# EAGLE design schematic (EAGLE 9.4.0)
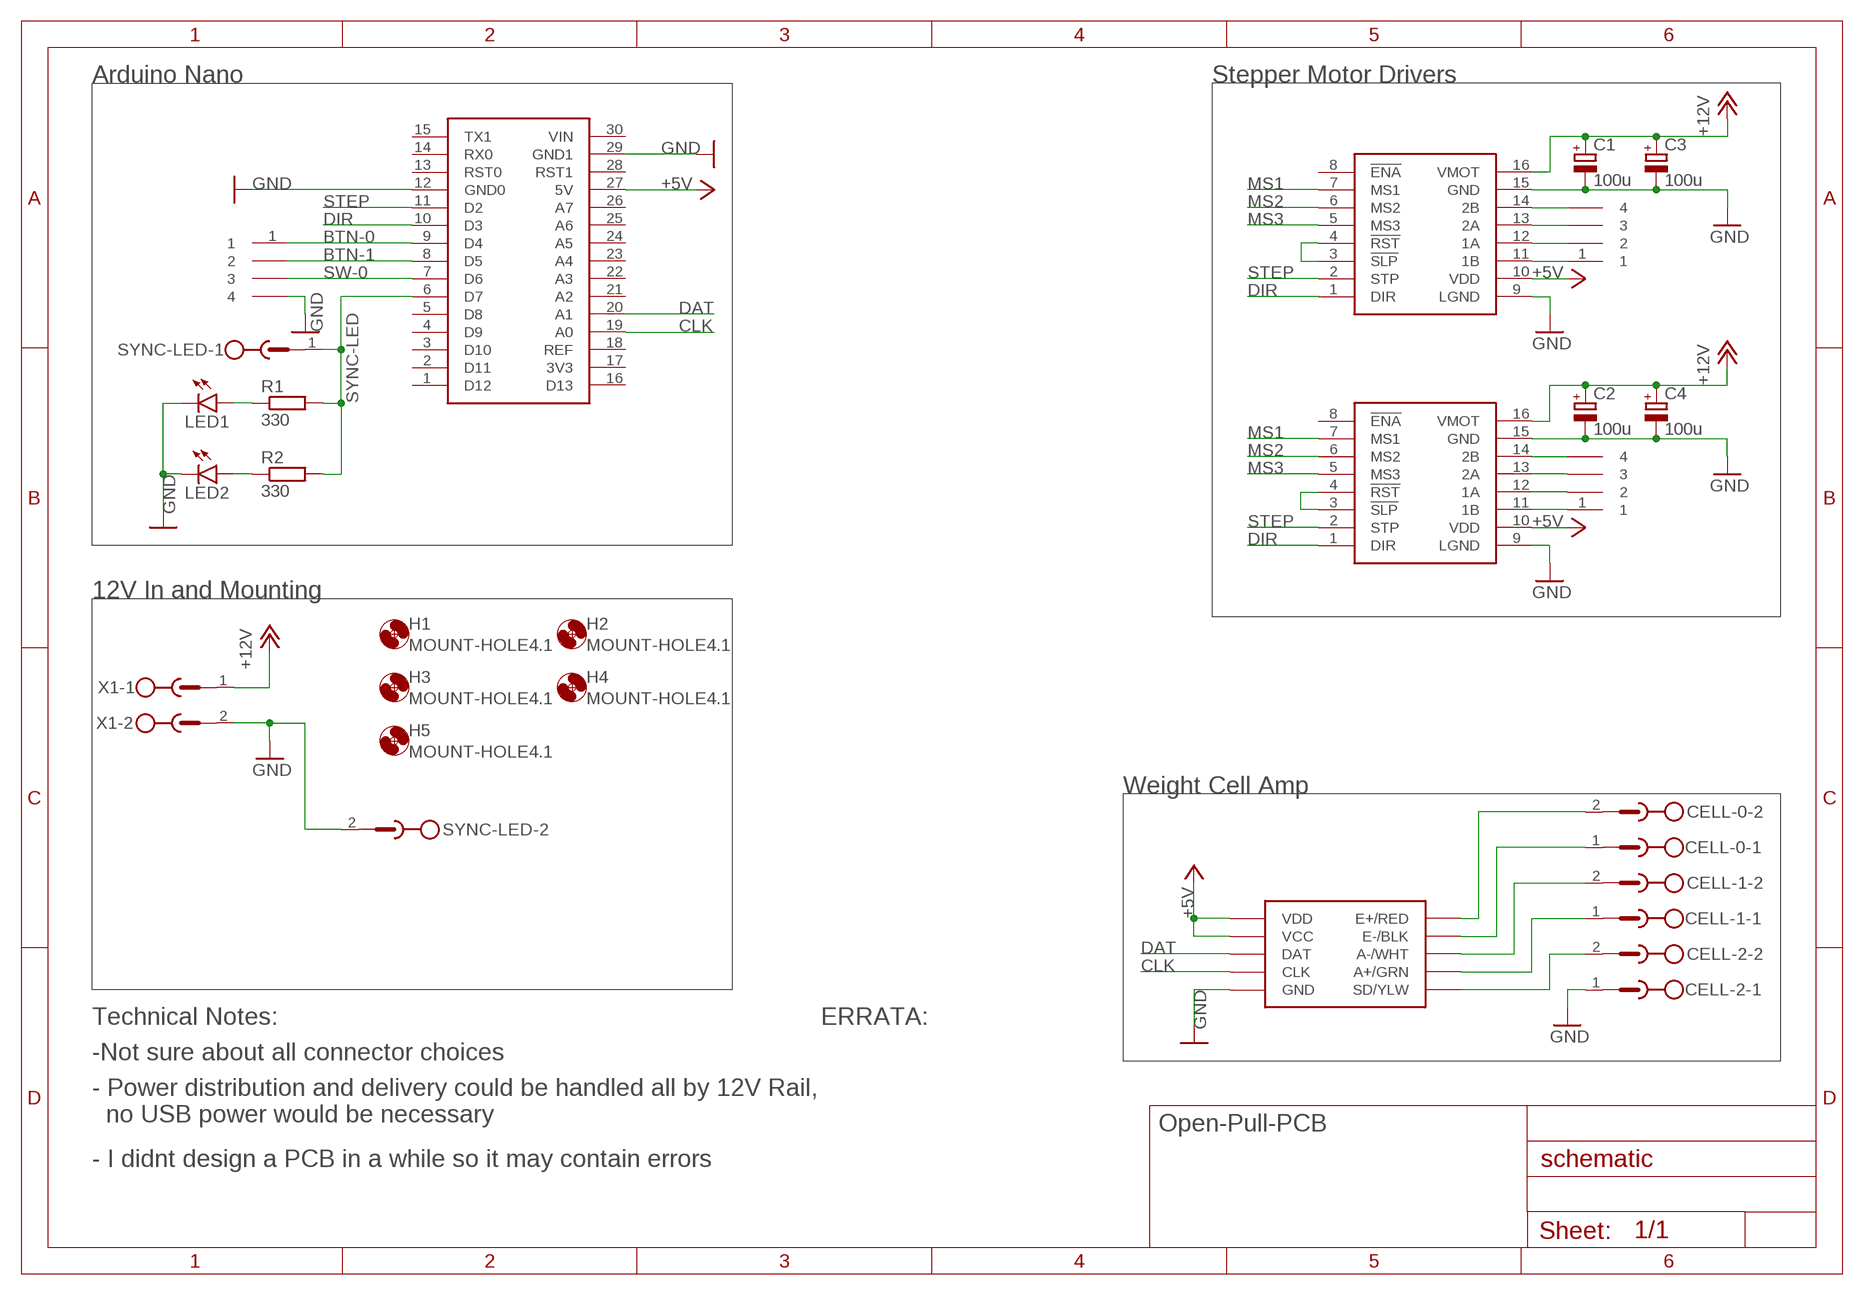
[diagram p0: schematic, sheet 1]

## Parts
C1  100u  CPOL  [3.5MM-CAP]
C2  100u  CPOL  [3.5MM-CAP]
C3  100u  CPOLSMD-CAP  [CAPAE830X1050]
C4  100u  CPOLSMD-CAP  [CAPAE830X1050]
CELL-0  MSTBV2  [MSTBV2]
CELL-1  MSTBV2  [MSTBV2]
CELL-2  MSTBV2  [MSTBV2]
CON1  CON-4GENERIC  [HDRV4W64P254_1X4_1016X508X838B]
CON2  CON-4GENERIC  [HDRV4W64P254_1X4_1016X508X838B]
CON3  CON-4GENERIC  [HDRV4W64P254_1X4_1016X508X838B]
DRIVER1  A4988-MODULE  [POLULU-A4988]
DRIVER2  A4988-MODULE  [POLULU-A4988]
H1  MOUNT-HOLE4.1  [4,1]
H2  MOUNT-HOLE4.1  [4,1]
H3  MOUNT-HOLE4.1  [4,1]
H4  MOUNT-HOLE4.1  [4,1]
H5  MOUNT-HOLE4.1  [4,1]
LED1  LEDCHIP-LED0805  [CHIP-LED0805]
LED2  LED3MM  [LED3MM]
MODULE1  HX711-MODULE  [SPARKFUN-HX711]
NANO1  ARDUINO-NANO  [ARDUINO-NANO]
R1  330  R-EU_R0805  [R0805]
R2  330  R-EU_0207/2V  [0207/2V]
SYNC-LED  MSTBV2  [MSTBV2]
X1  MSTBV2  [MSTBV2]

## Nets
+5V: DRIVER1.10(VDD) DRIVER2.10(VDD) MODULE1.VCC MODULE1.VDD NANO1.27(5V)
+12V: C1.+ C2.+ C3.1(+) C4.1(+) DRIVER1.16(VMOT) DRIVER2.16(VMOT) X1.1
BTN-0: CON3.1 NANO1.9(D4)
BTN-1: CON3.2 NANO1.8(D5)
CLK: MODULE1.CLK NANO1.19(A0)
DAT: MODULE1.DAT NANO1.20(A1)
DIR: DRIVER1.1(DIR) DRIVER2.1(DIR) NANO1.10(D3)
GND: C1.- C2.- C3.2(-) C4.2(-) CELL-2.1 CON3.4 DRIVER1.9(LGND) DRIVER1.15(GND) DRIVER2.9(LGND) DRIVER2.15(GND) LED1.C LED2.K(C) MODULE1.GND NANO1.12(GND0) NANO1.29(GND1) SYNC-LED.2 X1.2
MS1: DRIVER1.7(MS1) DRIVER2.7(MS1)
MS2: DRIVER1.6(MS2) DRIVER2.6(MS2)
MS3: DRIVER1.5(MS3) DRIVER2.5(MS3)
N$1: DRIVER2.3(!SLP) DRIVER2.4(!RST)
N$2: DRIVER1.3(!SLP) DRIVER1.4(!RST)
N$5: CON1.1 DRIVER1.11(1B)
N$6: CON1.2 DRIVER1.12(1A)
N$7: CON1.3 DRIVER1.13(2A)
N$8: CON1.4 DRIVER1.14(2B)
N$9: CON2.1 DRIVER2.11(1B)
N$10: CON2.2 DRIVER2.12(1A)
N$11: CON2.3 DRIVER2.13(2A)
N$12: CON2.4 DRIVER2.14(2B)
N$13: CELL-0.2 MODULE1.RED(E+/RED)
N$14: CELL-0.1 MODULE1.BLK(E-/BLK)
N$15: CELL-1.2 MODULE1.WHT(A-/WHT)
N$16: LED1.A R1.1
N$17: CELL-1.1 MODULE1.GRN(A+/GRN)
N$18: LED2.A R2.1
N$19: CELL-2.2 MODULE1.YEL(SD/YLW)
STEP: DRIVER1.2(STP) DRIVER2.2(STP) NANO1.11(D2)
SW-0: CON3.3 NANO1.7(D6)
SYNC-LED: NANO1.6(D7) R1.2 R2.2 SYNC-LED.1
Unconnected: DRIVER1.8(!ENA) DRIVER2.8(!ENA) NANO1.1(D12) NANO1.2(D11) NANO1.3(D10) NANO1.4(D9) NANO1.5(D8) NANO1.13(RST0) NANO1.14(RX0) NANO1.15(TX1) NANO1.16(D13) NANO1.18(REF) NANO1.21(A2) NANO1.22(A3) NANO1.23(A4) NANO1.24(A5) NANO1.25(A6) NANO1.26(A7) NANO1.28(RST1)

## Notes on the sheet
- Arduino Nano | Stepper Motor Drivers
- 12V In and Mounting
- Weight Cell Amp
- Technical Notes:
- ERRATA:
- -Not sure about all connector choices
- - Power distribution and delivery could be handled all by 12V Rail, 
    no USB power would be necessary
- Open-Pull-PCB
- - I didnt design a PCB in a while so it may contain errors

## Power pins joined to a net without a drawn wire
3V3: NANO1.17(3V3)
VIN: NANO1.30(VIN)

## Library data of the parts
C1-C4 = Open-Pull-Lib:CPOL: Polarized Electrolythic Capacitors Used Parts: THT: WURTH ELEKTRONIK 860020674015 - Farnell 2465814 SMT: WURTH ELEKTRONIK 865060653010 - Farnell 2466235
CELL-0 CELL-1 CELL-2 SYNC-LED X1 = con-phoenix-500:MSTBV2: PHOENIX; OC_FARNELL: unknown; OC_NEWARK: unknown
CON1-CON3 = Open-Pull-Lib:CON-4: Any 4 Pin 100mil/1.27mm spaced connector should fit, interlocking or not interlocking. Can also be used as common header
DRIVER1 DRIVER2 = Open-Pull-Lib:A4988-MODULE
H1-H5 = holes:MOUNT-HOLE: MOUNTING HOLE with drill center marker
LED1 LED2 = led:LED: LED OSRAM: - CHIPLED LG R971, LG N971, LY N971, LG Q971, LY Q971, LO R971, LY R971 LH N974, LH R974 LS Q976, LO Q976, LY Q976 LO Q996 - Hyper CHIPLED LW Q18S LB Q993, LB Q99A, LB R99A - SideLED LS A670, LO A670, LY A670, LG A670, LP A670 LB A673, LV A673, LT A673, LW A673 LH A674 LY A675 LS A676, LA A676, LO A676, LY A676, LW A676 LS A679, LY A679, LG A679 - Hyper Micro SIDELED® LS Y876, LA Y876, LO Y876, LY Y876 LT Y87S - SmartLED LW L88C, LW L88S LB L89C, LB L89S, LG L890 LS L89K, LO L89K, LY L89K LS L896, LA L896, LO L896, LY L896 - TOPLED LS T670, LO T670, LY T670, LG T670, LP T670 LSG T670, LSP T670, LSY T670, LOP T670, LYG T670 LG T671, LOG T671, LSG T671 LB T673, LV T673, LT T673, LW T673 LH T674 LS T676, LA T676, LO T676, LY T676, LB T676, LH T676, LSB T676, LW T676 LB T67C, LV T67C, LT T67C, LS T67K, LO T67K, LY T67K, LW E67C LS E67B, LA E67B, LO E67B, LY E67B, LB E67C, LV E67C, LT E67C LW T67C LS T679, LY T679, LG T679 LS T770, LO T770, LY T770, LG T770, LP T770 LB T773, LV T773, LT T773, LW T773 LH T774 LS E675, LA E675, LY E675, LS T675 LS T776, LA T776, LO T776, LY T776, LB T776 LHGB T686 LT T68C, LB T68C - Hyper Mini TOPLED® LB M676 - Mini TOPLED Santana® LG M470 LS M47K, LO M47K, LY M47K Source: http://www.osram.convergy.de LUXEON: - LUMILED® LXK2-PW12-R00, LXK2-PW12-S00, LXK2-PW14-U00, LXK2-PW14-V00 LXK2-PM12-R00, LXK2-PM12-S00, LXK2-PM14-U00 LXK2-PE12-Q00, LXK2-PE12-R00, LXK2-PE12-S00, LXK2-PE14-T00, LXK2-PE14-U00 LXK2-PB12-K00, LXK2-PB12-L00, LXK2-PB12-M00, LXK2-PB14-N00, LXK2-PB14-P00, LXK2-PB14-Q00 LXK2-PR12-L00, LXK2-PR12-M00, LXK2-PR14-Q00, LXK2-PR14-R00 LXK2-PD12-Q00, LXK2-PD12-R00, LXK2-PD12-S00 LXK2-PH12-R00, LXK2-PH12-S00 LXK2-PL12-P00, LXK2-PL12-Q00, LXK2-PL12-R00 Source: www.luxeon.com KINGBRIGHT: KA-3528ASYC Source: www.kingbright.com
MODULE1 = Open-Pull-Lib:HX711-MODULE: SparkFun Load Cell Apmplifier - HX711 https://www.sparkfun.com/products/13879
NANO1 = Open-Pull-Lib:ARDUINO-NANO
R1 R2 = rcl:R-EU_: RESISTOR, European symbol; SPICEPREFIX: R

## Board
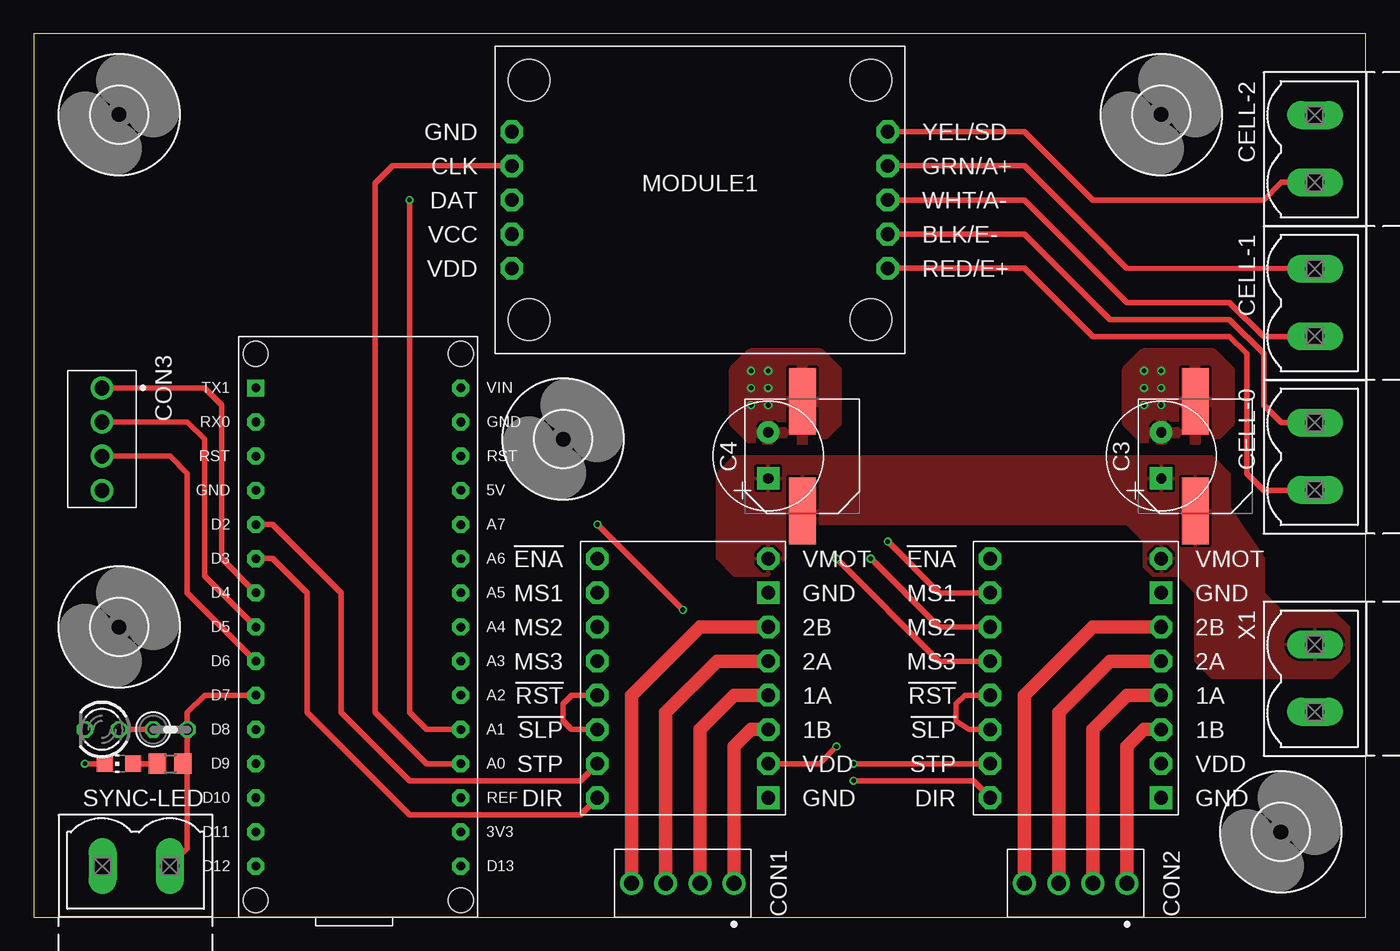
[diagram p1: board, top side]
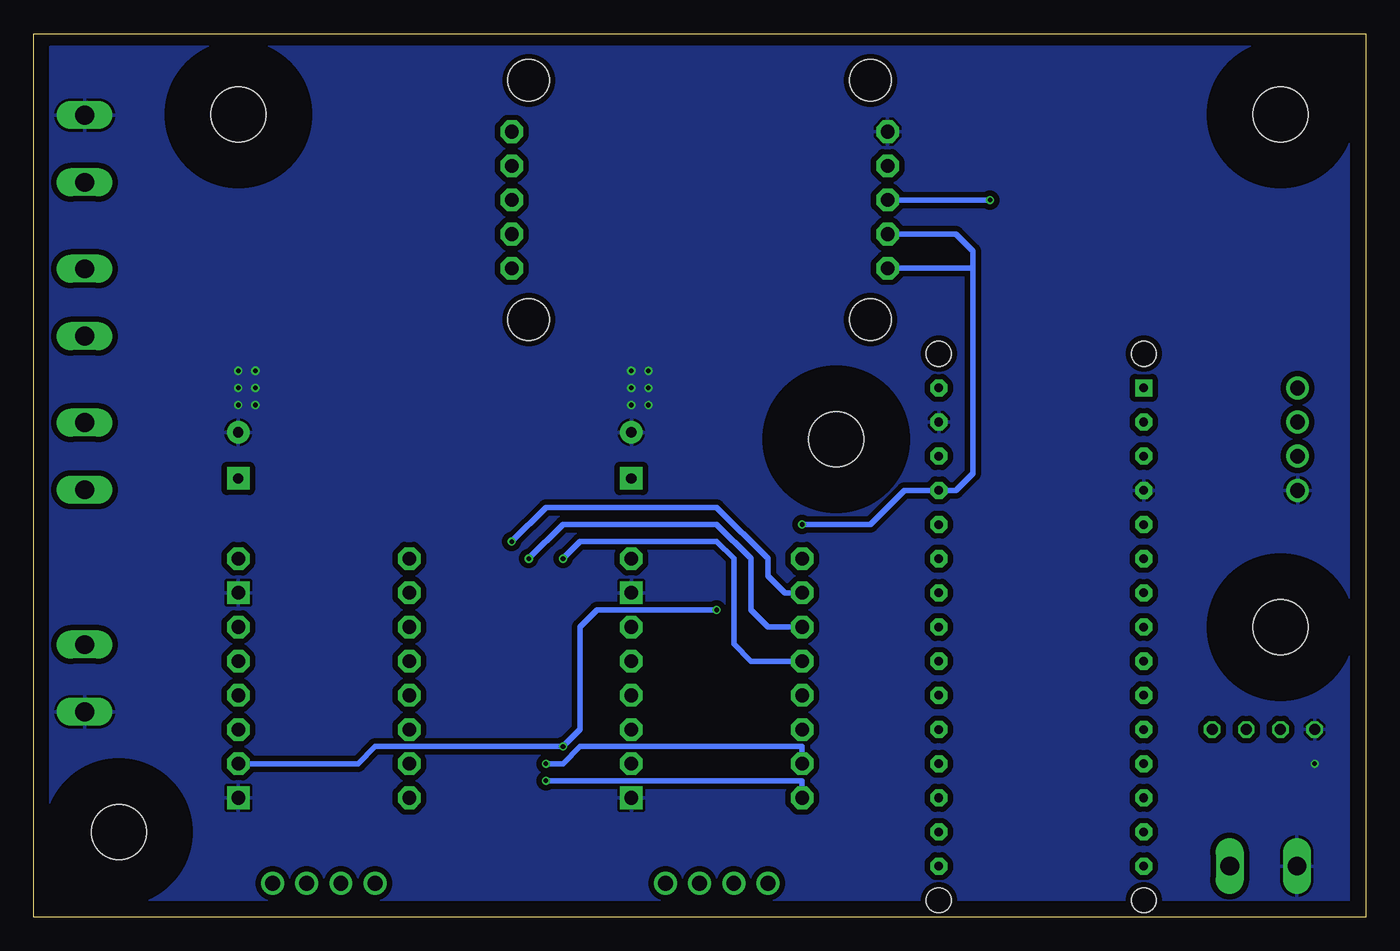
[diagram p2: board, bottom side, seen from below]

Size 99.04 x 65.71 mm. Coordinates in mm from the lower left corner, seen from the top.
Outline: 0,0 99.04,0 99.04,65.71 0,65.71 0,0
Copper layers (1*16): Top 0.018mm / dielectric 1.55mm / Bottom 0.018mm
Design rules "eC_2Layer_PClass6_BaseCopperO18_eCDefault": minimum track width 0.15mm, minimum drill 0.35mm, track to track 0.15mm, track to pad 0.15mm, pad to pad 0.15mm, via to via 0.15mm, smd to smd 0mil, copper to edge 0.25mm, drill to drill 0.35mm, minimum pad ring 0.175mm, minimum via ring 0.125mm, stop-mask expansion 0mil, vias tented up to drill 0.45mm, thermal gap 0.2mm

### Footprints (pad centres in the part's own frame; a part is rotated, then mirrored left to right if it is on the bottom)
3.5MM-CAP = drill 0.75 pad 1.676 square: + -1.651,0 | drill 0.75 pad 1.676: - 1.778,0
CAPAE830X1050 = smd 4.96 x 2.029: 1 -4.078,0; 2 4.078,0
MSTBV2 = drill 1.397 long: 1 -2.5,0; 2 2.5,0
HDRV4W64P254_1X4_1016X508X838B = drill 1.105 pad 1.705: 1 0,0; 2 2.54,0; 3 5.08,0; 4 7.62,0
POLULU-A4988 = drill 1.016 pad 1.676 octagon: 1 1.27,1.27; 2 1.27,3.81; 3 1.27,6.35; 4 1.27,8.89; 5 1.27,11.43; 6 1.27,13.97; 7 1.27,16.51; 8 1.27,19.05; 10 13.97,3.81; 11 13.97,6.35; 12 13.97,8.89; 13 13.97,11.43; 14 13.97,13.97; 16 13.97,19.05 | drill 1.016 pad 1.676 square: 9 13.97,1.27; 15 13.97,16.51
4,1 = hole 4.1: 0,0
CHIP-LED0805 = smd 1.2 x 1.2: A 0,-1.05; C 0,1.05
LED3MM = drill 0.813 octagon: A -1.27,0; K 1.27,0
SPARKFUN-HX711 = drill 1.016 pad 1.676 octagon: BLK 29.21,8.89; CLK 1.27,13.97; DAT 1.27,11.43; GND 1.27,16.51; GRN 29.21,13.97; RED 29.21,6.35; VCC 1.27,8.89; VDD 1.27,6.35; WHT 29.21,11.43; YEL 29.21,16.51 | hole 3.1: 2.54,20.32; 2.54,2.54; 27.94,2.54; 27.94,20.32
ARDUINO-NANO = drill 0.635 pad 1.27 octagon: 1 0,2.54; 2 0,5.08; 3 0,7.62; 4 0,10.16; 5 0,12.7; 6 0,15.24; 7 0,17.78; 8 0,20.32; 9 0,22.86; 10 0,25.4; 11 0,27.94; 12 0,30.48; 13 0,33.02; 14 0,35.56; 16 15.24,2.54; 17 15.24,5.08; 18 15.24,7.62; 19 15.24,10.16; 20 15.24,12.7; 21 15.24,15.24; 22 15.24,17.78; 23 15.24,20.32; 24 15.24,22.86; 25 15.24,25.4; 26 15.24,27.94; 27 15.24,30.48; 28 15.24,33.02; 29 15.24,35.56; 30 15.24,38.1 | drill 0.635 pad 1.27 square: 15 0,38.1 | hole 1.85: 0,0; 15.24,0; 0,40.64; 15.24,40.64
R0805 = smd 1.3 x 1.5: 1 -0.95,0; 2 0.95,0
0207/2V = drill 0.813 octagon: 1 -1.27,0; 2 1.27,0

### Placement (x,y rotation side)
C1  54.61,34.29 90 top
C2  83.82,34.29 90 top
C3  86.36,34.29 90 top
C4  57.15,34.29 90 top
CELL-0  95.25,34.29 270 top
CELL-1  95.25,45.72 270 top
CELL-2  95.25,57.15 270 top
CON1  52.07,2.54 180 top
CON2  81.28,2.54 180 top
CON3  5.08,39.37 270 top
DRIVER1  40.64,7.62 0 top
DRIVER2  69.85,7.62 0 top
H1  83.82,59.69 0 top
H2  6.35,59.69 0 top
H3  92.71,6.35 0 top
H4  39.37,35.56 0 top
H5  6.35,21.59 0 top
LED1  6.35,11.43 90 top
LED2  5.08,13.97 180 top
MODULE1  34.29,41.91 0 top
NANO1  16.51,1.27 0 top
R1  10.16,11.43 0 top
R2  10.16,13.97 0 top
SYNC-LED  7.62,3.81 180 top
X1  95.25,17.78 270 top

### Tracks (layer width: path | path; a pad name or v marks a point on that pad's centre or on a via)
+5V  (via drill 0.35)
  Top 0.406: v59.69,12.7 58.42,11.43 DRIVER1.10 | v41.91,29.21 v48.26,22.86
  Bottom 0.406: DRIVER2.10 74.93,11.43 73.66,12.7 v59.69,12.7 58.42,13.97 58.42,21.59 57.15,22.86 v48.26,22.86 | v41.91,29.21 36.83,29.21 34.29,31.75 NANO1.27 30.48,31.75 29.21,33.02 29.21,48.26 | MODULE1.VCC 30.48,50.8 29.21,49.53 29.21,48.26 | MODULE1.VDD 29.21,48.26
+12V
  pour Top: 97.79,19.05 96.52,17.78 87.63,17.78 86.36,19.05 86.36,24.13 85.09,25.4 83.19,25.4 82.55,26.04 82.55,27.94 81.28,29.21 55.88,29.21 55.88,26.67 54.61,25.4 52.07,25.4 50.8,26.67 50.8,33.02 52.07,34.29 87.63,34.29 88.9,33.02 88.9,30.48 91.44,26.67 91.44,24.13 92.71,22.86 96.52,22.86 97.79,21.59
BTN-0
  Top 0.406: NANO1.9 13.97,26.67 13.97,38.1 12.7,39.37 CON3.1
BTN-1
  Top 0.406: NANO1.8 12.7,25.4 12.7,35.56 11.43,36.83 CON3.2
CLK
  Top 0.406: MODULE1.CLK 26.67,55.88 25.4,54.61 25.4,15.24 29.21,11.43 NANO1.19
DAT  (via drill 0.35)
  Top 0.406: NANO1.20 29.21,13.97 27.94,15.24 v27.94,53.34
  Bottom 0.406: v27.94,53.34 MODULE1.DAT
DIR  (via drill 0.35)
  Top 0.406: NANO1.10 17.78,26.67 20.32,24.13 20.32,15.24 27.94,7.62 40.64,7.62 DRIVER1.1 | v60.96,10.16 69.85,10.16 DRIVER2.1
  Bottom 0.406: DRIVER1.1 41.91,10.16 v60.96,10.16
GND  (via drill 0.35)
  Top 0.406: LED1.C v3.81,11.43
  other vias: 82.55,40.64 83.82,40.64 82.55,39.37 83.82,39.37 83.82,38.1 82.55,38.1 53.34,40.64 54.61,40.64 54.61,39.37 53.34,39.37 53.34,38.1 54.61,38.1
  pour Bottom (isolate 0.406): 1.27,1.27 97.79,1.27 97.79,64.77 1.27,64.77
  pour Top: 87.63,41.91 82.55,41.91 81.28,40.64 81.28,36.83 82.55,35.56 87.63,35.56 88.9,36.83 88.9,40.64
  pour Top: 58.42,35.56 59.69,36.83 59.69,40.64 58.42,41.91 53.34,41.91 52.07,40.64 52.07,36.83 53.34,35.56
MS1  (via drill 0.35)
  Top 0.406: DRIVER2.7 67.31,24.13 v63.5,27.94
  Bottom 0.406: v63.5,27.94 60.96,30.48 48.26,30.48 44.45,26.67 44.45,25.4 43.18,24.13 DRIVER1.7
MS2  (via drill 0.35)
  Top 0.406: v62.23,26.67 67.31,21.59 DRIVER2.6
  Bottom 0.406: v62.23,26.67 59.69,29.21 48.26,29.21 45.72,26.67 45.72,22.86 44.45,21.59 DRIVER1.6
MS3  (via drill 0.35)
  Top 0.406: DRIVER2.5 67.31,19.05 v59.69,26.67
  Bottom 0.406: v59.69,26.67 58.42,27.94 48.26,27.94 46.99,26.67 46.99,20.32 45.72,19.05 DRIVER1.5
N$1
  Top 0.406: DRIVER2.4 69.22,16.51 68.58,15.88 68.58,14.61 69.53,13.97 DRIVER2.3
N$2
  Top 0.406: DRIVER1.4 40,16.51 39.37,15.88 39.37,14.61 40,13.97 DRIVER1.3
N$5
  Top 1.016: DRIVER1.11 53.34,13.97 52.07,12.7 CON1.1
N$6
  Top 1.016: DRIVER1.12 52.07,16.51 49.53,13.97 CON1.2
N$7
  Top 1.016: DRIVER1.13 50.8,19.05 46.99,15.24 CON1.3
N$8
  Top 1.016: DRIVER1.14 49.53,21.59 44.45,16.51 CON1.4
N$9
  Top 1.016: DRIVER2.11 82.55,13.97 81.28,12.7 CON2.1
N$10
  Top 1.016: DRIVER2.12 81.28,16.51 78.74,13.97 CON2.2
N$11
  Top 1.016: DRIVER2.13 80.01,19.05 76.2,15.24 CON2.3
N$12
  Top 1.016: DRIVER2.14 78.74,21.59 73.66,16.51 CON2.4
N$13
  Top 0.406: MODULE1.RED 73.66,48.26 78.74,43.18 88.9,43.18 90.17,41.91 90.17,33.02 91.44,31.75 95.21,31.75 CELL-0.2
N$14
  Top 0.406: MODULE1.BLK 73.66,50.8 80.01,44.45 88.9,44.45 91.44,41.91 91.44,38.1 92.75,36.79 CELL-0.1
N$15
  Top 0.406: MODULE1.WHT 73.66,53.34 81.28,45.72 88.9,45.72 91.44,43.18 95.21,43.18 CELL-1.2
N$16
  Top 0.406: R1.1 LED1.A
N$17
  Top 0.406: MODULE1.GRN 73.66,55.88 78.74,50.8 81.24,48.26 CELL-1.1
N$18
  Top 0.406: R2.1 LED2.A
N$19
  Top 0.406: MODULE1.YEL 73.66,58.42 78.74,53.34 91.44,53.34 92.75,54.65 CELL-2.2
STEP  (via drill 0.35)
  Top 0.406: NANO1.11 17.78,29.21 22.86,24.13 22.86,15.24 27.94,10.16 40.64,10.16 DRIVER1.2 | v60.96,11.43 DRIVER2.2
  Bottom 0.406: DRIVER1.2 41.91,12.7 58.42,12.7 59.69,11.43 v60.96,11.43
SW-0
  Top 0.406: NANO1.7 11.43,24.13 11.43,33.02 10.16,34.29 CON3.3
SYNC-LED
  Top 0.406: NANO1.6 12.7,16.51 11.43,15.24 R2.2 | R2.2 11.43,11.75 R1.2 | R2.2 11.43,5.12 SYNC-LED.1